# Altium schematic sheet schametic.SchDoc
size 420 x 297 mm; SheetNumber: 1; SheetTotal: 1
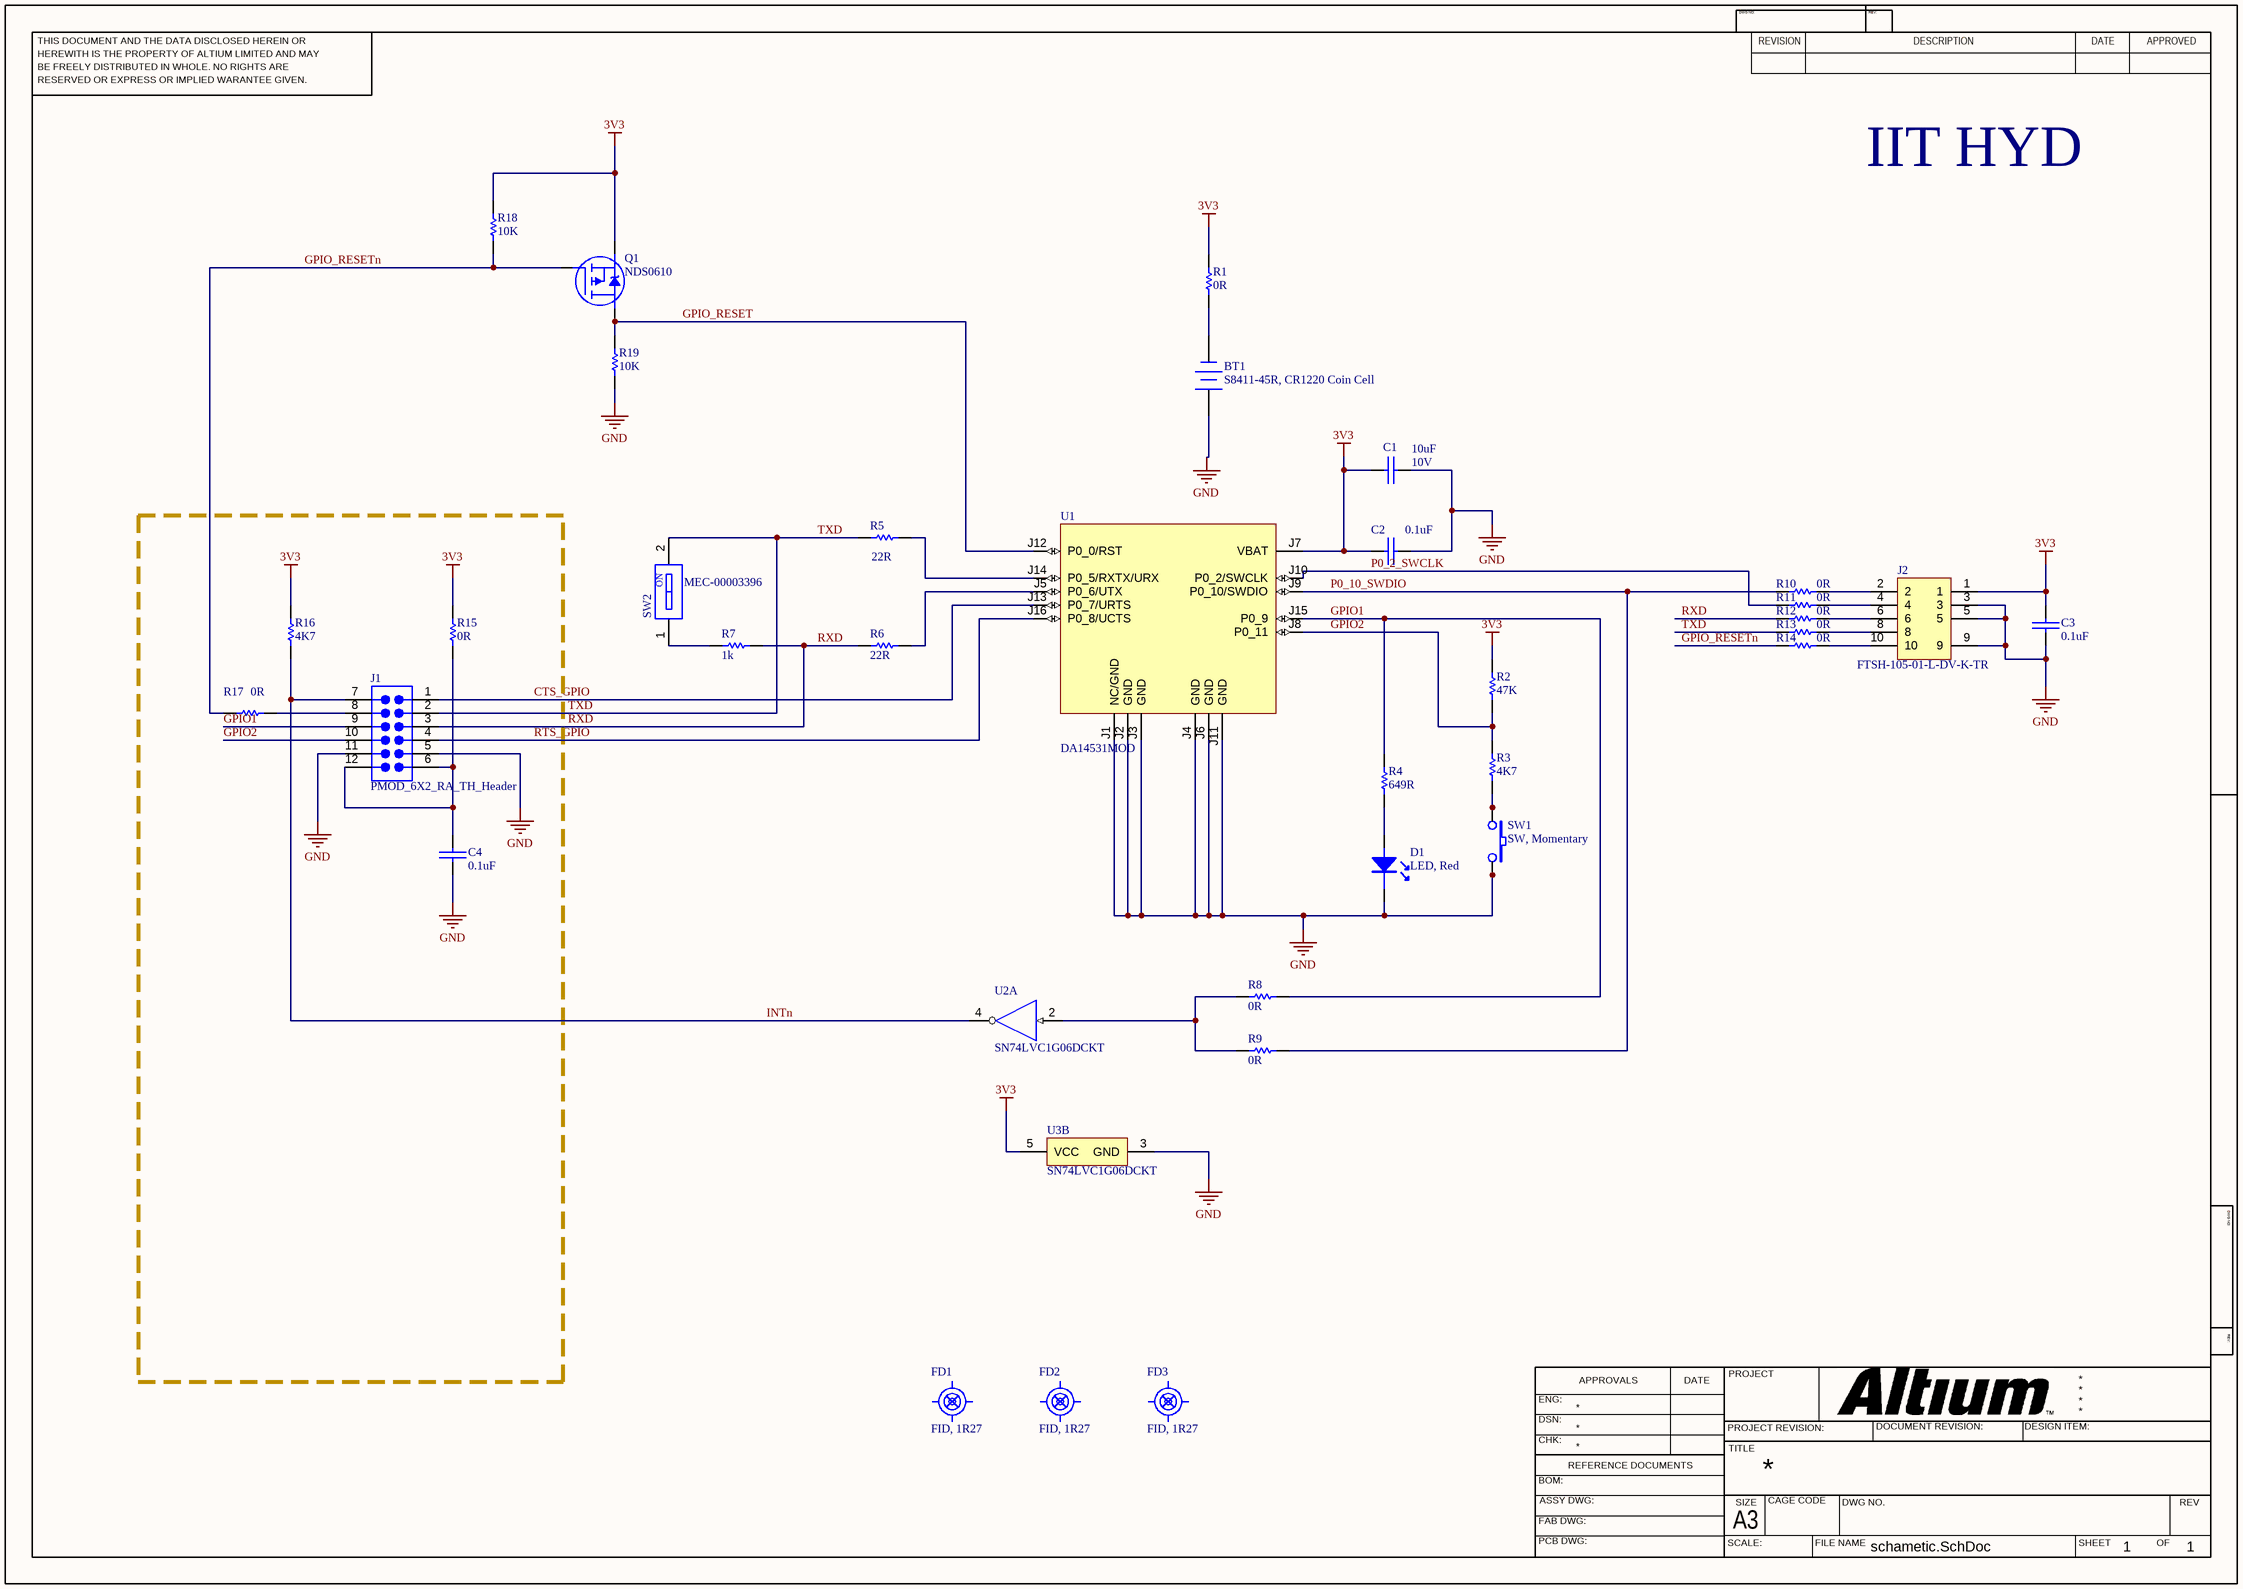
[diagram p0: schametic.SchDoc]

## Parts
BT1  S8411-45R, CR1220 Coin Cell  [HWN_S8411-45R]
C1  10uF  Voltage Rating: 10V  [CAPC1608X10N]
C2  0.1uF  [CAPC1608X09N]
C3  0.1uF  [CAPC1608X09N]
C4  0.1uF  [CAPC1608X09N]
D1  LED, Red  [DIOC2012X08N_WTE]
FD1  FID, 1R27  [FD_ML_1R27]  (no BOM)
FD2  FID, 1R27  [FD_ML_1R27]  (no BOM)
FD3  FID, 1R27  [FD_ML_1R27]  (no BOM)
J1  PMOD_6X2_RA_TH_Header  [PMOD-CONN2X6-RA-TH-HDR]
J2  FTSH-105-01-L-DV-K-TR  [SAM_FTSH-105-01-L-DV-007-K]
Q1  NDS0610  [SOT95P275X112-3NF]
R1  0R  [RESC1608X06N]
R2  47K  [RESC1608X06N]
R3  4K7  [RESC1608X06N]
R4  649R  [RESC1608X06N]
R5  22R  [RESC1608X06N]
R6  22R  [RESC1608X06N]
R7  value 1k  [RESC0603-01]  (hidden comment: RES-100096-01)
R8  0R  [RESC1608X06N]
R9  0R  [RESC1608X06N]
R10  0R  [RESC1608X06N]
R11  0R  [RESC1608X06N]
R12  0R  [RESC1608X06N]
R13  0R  [RESC1608X06N]
R14  0R  [RESC1608X06N]
R15  0R  [RESC1608X06N]
R16  4K7  [RESC1608X06N]
R17  0R  [RESC1608X06N]
R18  10K  [RESC1608X06N]
R19  10K  [RESC1608X06N]
SW1  SW, Momentary  [SW_PTS810]
SW2  MEC-00003396  [416131160801]
U1  DA14531MOD  [DLG_DA14531MOD-00F01002]
U2  SN74LVC1G06DCKT  [SOT65P210X110-5N]  (part A of 2)
U3  SN74LVC1G06DCKT  [SOT65P210X110-5N]  (part B of 2)

## Nets
3V3: C1.1 C2.1 C3.1 J2.1 Q1.S R1.1 R2.1 R15.1 R16.1 R18.1 U1.J7(VBAT) U3.5(VCC)
GND: BT1.1(+) C1.2 C2.2 C3.2 C4.2 D1.K J1.5 J1.11 J2.3 J2.5 J2.9 R19.2 SW1.3 SW1.4 U1.J1(NC/GND) U1.J2(GND) U1.J3(GND) U1.J4(GND) U1.J6(GND) U1.J11(GND) U3.3(GND)
CTS_GPIO: J1.1 U1.J13(P0_7/URTS)
GPIO1: J1.9 R4.1 R8.2 U1.J15(P0_9)
GPIO2: J1.10 R2.2 R3.1 U1.J8(P0_11)
GPIO_RESET: Q1.D R19.1 U1.J12(P0_0/RST)
GPIO_RESETn: Q1.G R14.1 R17.1 R18.2
INTn: J1.7 R16.2 U2.4(Y)
P0_2_SWCLK: R11.1 U1.J10(P0_2/SWCLK)
P0_10_SWDIO: R9.2 R10.1 U1.J9(P0_10/SWDIO)
RTS_GPIO: J1.4 U1.J16(P0_8/UCTS)
RXD: J1.3 R6.1 R7.2 R12.1
TXD: J1.2 R5.1 R13.1 SW2.2
NetBT1_2: BT1.2(-) R1.2
NetC4_1: C4.1 J1.6 J1.12 R15.2
NetD1_A: D1.A R4.2
NetJ1_8: J1.8 R17.2
NetJ2_2: J2.2 R10.2
NetJ2_4: J2.4 R11.2
NetJ2_6: J2.6 R12.2
NetJ2_8: J2.8 R13.2
NetJ2_10: J2.10 R14.2
NetR3_2: R3.2 SW1.1 SW1.2
NetR5_2: R5.2 U1.J14(P0_5/RXTX/URX)
NetR6_2: R6.2 U1.J5(P0_6/UTX)
NetR7_1: R7.1 SW2.1
NetR8_1: R8.1 R9.1 U2.2(A)

## Notes on the sheet
- IIT HYD
- THIS DOCUMENT AND THE DATA DISCLOSED HEREIN OR
- HEREWITH IS THE PROPERTY OF ALTIUM LIMITED AND MAY
- DWG NO:
- REVISION
- REV:
- DESCRIPTION
- DATE
- APPROVED
- BE FREELY DISTRIBUTED IN WHOLE. NO RIGHTS ARE
- RESERVED OR EXPRESS OR IMPLIED WARANTEE GIVEN.
- ENG:
- APPROVALS
- PROJECT
- DSN:
- CHK:
- REFERENCE DOCUMENTS
- PROJECT REVISION:
- TITLE
- DOCUMENT REVISION:
- DESIGN ITEM:
- BOM:
- FAB DWG:
- PCB DWG:
- ASSY DWG:
- SCALE:
- A3
- SIZE
- CAGE CODE
- FILE NAME
- DWG NO.
- SHEET
- OF
- REV
- (in symbol CMP-011-00036-1) ON

## Library data of the parts
BT1 = BT-S8411-45R-SR-HWN: Battery Holder, 12 mm Coin Cell, CR1220 SM; Manufacturer: Harwin; Detailed Description: Battery Holder, 12 mm Coin Cell, CR1220, SM, RoHS; Part: S8411-45R, CR1220 Coin Cell; Type: Battery Holder; Manufacturer's Part #: S8411-45R; Revision: 1; Supplier 1: Digi-Key; Supplier 2: Mouser; Supplier Part Number 1: 952-1745-1-ND; Supplier Part Number 2: 855-S8411-45R
C1 = CI-10uF-10V-X5R-SR-MRT: Capacitor, 10uF, 10V, SM; Manufacturer's Part #: GRM188R61A106KE69D; Manufacturer: Murata; Detailed Description: Capacitor, 10uF, 10V, SM 0603, Multilayer Ceramic, X5R, RoHS; Tolerance: 10%; Part: 10uF; Type: Capacitor; Revision: 1; Supplier 1: Digi-Key; Supplier 2: Mouser; Supplier Part Number 1: 490-10474-1-ND; Supplier Part Number 2: 81-GRM188R61A106KE9D; Package: 0603
C2-C4 = CI-0.1uF-50V-X7R-SR-YAG: Capacitor, 0.1uF, 50V, SM; Manufacturer's Part #: CC0603KRX7R9BB104; Manufacturer: Yageo; Detailed Description: Capacitor, 0.1uF, 50V, SM 0603, Multilayer Ceramic,, X7R, RoHS; Tolerance: 10%; Part: 0.1uF; Type: Capacitor; Revision: 1; Package: 0603; Voltage Rating: 50V; Supplier 1: Digi-Key; Supplier 2: Future Electronics; Supplier 3: Mouser; Supplier Part Number 1: 311-1344-1-ND; Supplier Part Number 2: 9017302; Supplier Part Number 3: 603-CC603KRX7R9BB104
D1 = DA-150080RS75000-SR-WTE: LED, Red, 0805 SM; Manufacturer: Wurth Elektronik; Detailed Description: LED, Red, Clear, 0805, SM, RoHS; Part: LED, Red; Type: LED; Manufacturer's Part #: 150080RS75000; Revision: 1; Package: 0805; Supplier 1: Digi-Key; Supplier 2: Mouser; Supplier Part Number 1: 732-4984-1-ND; Supplier Part Number 2: 710-150080RS75000
FD1-FD3 = FD-ML1R27-SR-BDH: Fiducial, 1.27mm D, Multilayer; Manufacturer: PCB Fabricator; Detailed Description: Fiducial, 1.27mm D, Multilayer, RoHS; Part: FID, 1R27; Type: Fiducial; Revision: 1
J1 = CMP-024-000000-2: Male Header 0.1" pitch PMOD 2x6 Right Angle, through hole; Manufacturer 1: Wurth; Manufacturer Part Number 1: 61301221021; Pitch: 2.54mm; Positions: 12; Manufacturer Part Number 2: TSW-106-08-F-D-RA; Manufacturer Part Number 3: M20-9950645; Manufacturer 3: Harwin; Manufacturer 2: Samtec Inc.; Source: PMOD_Conn.SchLib; Design Item ID: PMOD_6X2_RA_TH_Header
J2 = JH-2X5VH-FTSH-105-01-L-DV-007-K-SR-SAM: Connector, 2X5 Header, Vertical, 1.27mm Pitch, Pin 7, SM; Manufacturer: Samtec; Detailed Description: Connector, 2X5 Header, Vertical, 1.27mm Pitch, Pin 7, SM, RoHS; Current Rating: 3.4A (max. 2 pins); Part: FTSH-105-01-L-DV-K-TR; Type: Connector; Manufacturer's Part #: FTSH-105-01-L-DV-007-K; Supplier 1: Digi-Key; Supplier 2: Mouser; Supplier Part Number 1: SAM9438-ND; Supplier Part Number 2: 200-FTSH10501LDV007K; Revision: 1
Q1 = QA-NDS0610-SR-ONS: Transistor, P-Ch Mosfet, 60V, 120mA, 10Ohm, SM; Manufacturer: On Semiconductor; Type: N-Ch Mosfet; Detailed Description: Transistor, P-Ch Mosfet, 60V, 120mA, 10Ohm, SM, SOT23-3, RoHS; Part: NDS0610; Manufacturer's Part #: NDS0610; Revision: 1; Current Rating: 120mA; Package: SOT23-3; Resistance: 10Ohm; Voltage Rating: 60V; Supplier 1: Digi-Key; Supplier 2: Newark; Supplier 3: Mouser; Supplier Part Number 1: NDS0610CT-ND; Supplier Part Number 2: 58K2015; Supplier Part Number 3: 512-NDS0610
R1 R8-R15 R17 = RP-0-SR-KOA: Resistor, 0 ohms, 1/8W, 1%, SM; Manufacturer's Part #: RK73Z1JTTD; Manufacturer: KOA Speer; Detailed Description: Resistor, 0 ohms, 1/8W, 1%, 100 ppm, SM, 75 WV, 100 OV, Thick Film, 0603, RoHS; Voltage Rating: 75V; Resistance: 0; Part: 0R; Type: Resistor; Revision: 1; Power Rating: 1/8W; Tolerance: 1%; Package: 0603; Supplier 1: Arrow Electronics; Supplier 2: Digi-Key; Supplier 3: Mouser; Supplier Part Number 1: RK73Z1JTTD; Supplier Part Number 2: 2019-RK73Z1JTTDCT-ND; Supplier Part Number 3: 660-RK73Z1JTTD
R2 = RP-47K-SR-KOA: Resistor, 47K ohms, 1/8W, 1%, SM; Manufacturer's Part #: RK73H1JTTD6802F; Manufacturer: KOA Speer; Detailed Description: Resistor, 47K ohms, 1/8W, 1%, 100 ppm, SM, 75 WV, 100 OV, Thick Film, 0603, RoHS; Voltage Rating: 75V; Part: 47K; Type: Resistor; Revision: 1; Power Rating: 1/8W; Tolerance: 1%; Resistance: 47K; Package: 0603; Supplier 1: Digi-Key; Supplier 2: Mouser; Supplier 3: Arrow Electronics; Supplier Part Number 1: 2019-RK73H1JTTD6802FCT-ND; Supplier Part Number 2: 660-RK73H1JTTD6802F; Supplier Part Number 3: RK73H1JTTD6802F
R3 R16 = RP-4.7K-SR-KOA: Resistor, 4.7K ohms, 1/8W, 1%, SM; Manufacturer's Part #: RK73H1JTTD4701F; Manufacturer: KOA Speer; Detailed Description: Resistor, 4.7K ohms, 1/8W, 1%, 100 ppm, SM, 75 WV, 100 OV, Thick Film, 0603, RoHS; Voltage Rating: 75V; Part: 4K7; Type: Resistor; Revision: 1; Power Rating: 1/8W; Tolerance: 1%; Resistance: 4.7K; Package: 0603; Supplier 1: Digi-Key; Supplier 2: Mouser; Supplier Part Number 1: 2019-RK73H1JTTD4701FCT-ND; Supplier Part Number 2: 660-RK73H1JTTD4701F
R4 = RP-649-SR-KOA: Resistor, 649 ohms, 1/8W, 1%, SM; Manufacturer's Part #: RK73H1JTTD6490F; Manufacturer: KOA Speer; Detailed Description: Resistor, 649 ohms, 1/8W, 1%, 100 ppm, SM, 75 WV, 100 OV, Thick Film, 0603, RoHS; Voltage Rating: 75V; Resistance: 649; Part: 649R; Type: Resistor; Revision: 1; Power Rating: 1/8W; Tolerance: 1%; Package: 0603; Supplier 1: Digi-Key; Supplier 2: Mouser; Supplier 3: Arrow Electronics; Supplier Part Number 1: 2019-RK73H1JTTD6490FCT-ND; Supplier Part Number 2: 660-RK73H1JTTD6490F; Supplier Part Number 3: RK73H1JTTD6490F
R5 R6 = RP-22-SR-KOA: Resistor, 22 ohms, 1/8W, 1%, SM; Manufacturer's Part #: RK73H1JTTD22R0F; Manufacturer: KOA Speer; Detailed Description: Resistor, 22 ohms, 1/8W, 1%, 100 ppm, SM, 75 WV, 100 OV, Thick Film, 0603, RoHS; Voltage Rating: 75V; Resistance: 22; Part: 22R; Type: Resistor; Revision: 1; Power Rating: 1/8W; Tolerance: 1%; Package: 0603; Supplier 1: Digi-Key; Supplier 2: Arrow Electronics; Supplier 3: Mouser; Supplier Part Number 1: 2019-RK73H1JTTD22R0FCT-ND; Supplier Part Number 2: RK73H1JTTD22R0F; Supplier Part Number 3: 660-RK73H1JTTD22R0F
R7 = CMP-009-00240-1: Chip Resistor Thick Film 0603 1K0 ohm 1% 1/10W; Manufacturer 1: Vishay Dale; Power: 100mW; PN: CRCW06031K00FKEAC; Design Item ID: RES-100096-01; Pins: 2; Tolerance: 1%; Mfg: Vishay Dale; Case/Package: 0603; Mfg Part Number: CRCW06031K00FKEAC; Manufacturer: Vishay Dale; Manufacturer Part Number 1: CRCW06031K00FKEAC; Component Type: Standard; Source: AME-MPU-RZA3UL_v1.SCHLIB
R18 R19 = RP-10K-SR-KOA: Resistor, 10K ohms, 1/8W, 1%, SM; Manufacturer's Part #: RK73H1JTTD1002F; Manufacturer: KOA Speer; Detailed Description: Resistor, 10K ohms, 1/8W, 1%, 100 ppm, SM, 75 WV, 100 OV, Thick Film, 0603, RoHS; Voltage Rating: 75V; Part: 10K; Type: Resistor; Revision: 1; Power Rating: 1/8W; Tolerance: 1%; Resistance: 10K; Package: 0603; Supplier 1: Digi-Key; Supplier 2: Mouser; Supplier 3: Arrow Electronics; Supplier Part Number 1: 2019-RK73H1JTTD1002FCT-ND; Supplier Part Number 2: 660-RK73H1JTTD1002F; Supplier Part Number 3: RK73H1JTTD1002F
SW1 = SW-PTS810SJG250-SR-CKC: Switch, Pushbutton, Top Actuated, SM; Manufacturer's Part #: PTS810 SJG 250 SMTR LFS; Manufacturer: C&K Components; Detailed Description: Switch, Pushbutton, Top Actuated, SM, RoHS; Part: SW, Momentary; Type: Switch, Pushbutton; Revision: 1; Supplier 1: Digi-Key; Supplier 2: Newark; Supplier Part Number 1: CKN10504CT-ND; Supplier Part Number 2: 35AH5293
SW2 = CMP-011-00036-1: WS-DISV Small Compact SMT Flat Actuator with Top Tape 1.27 mm; Manufacturer 1: Wurth Elektronik; Current: 100mA; Value: 416131160801; Voltage: 50V; Checked: OK; Height: 2.65; Operating Temperature: -40~85°C; ComponentLink1URL: https://ree-du1svn.ree.adwin.renesas.com/du1svn2/REE_PCB_ACLIB/ADLib/pdf/00003396_416131160801.pdf; Category: Mechanical; Manufacturer Part Number 1: 416131160801; PartNumber: MEC-00003396; Pins: 2; ComponentLink1Description: Datasheet
U1 = UD-DA14531MOD-00F01002-SR-DLG: DA14531MOD, Bluetooth Low Energy 5.1 Module, SM; Manufacturer 1: Renesas Electronics; Detailed Description: DA14531MOD, Bluetooth Low Energy 5.1 Module, 128 kB Flash, 144kB ROM, 48kB RAM, 16-SMD Module, SM, RoHS; Manufacturer Part Number 1: DA14531MOD-00F01002; Part: DA14531MOD; Type: BLE 5.1 Module; Revision: 1; Package: 16-SMD Module; Supplier 1: Digi-Key; Supplier 2: Mouser; Supplier Part Number 1: 1695-DA14531MOD-00F01002CT-ND; Supplier Part Number 2: 724-DA14531MODF01002
U2 U3 = UD-SN74LVC1G06DCKT-SR-TXI: IC, Digital, Buffer,  Inverting, Open Drain, SM; Manufacturer: Texas Instruments; Alternate Part #: SN74LVC1G07DCKR; Detailed Description: IC, Digital, Buffer, Inverting, Open Drain, SM, SC-70-5, RoHS; Manufacturer's Part #: SN74LVC1G06DCKT; Part: SN74LVC1G06DCKT; Type: Buffer; Package: SC-70-5; Alternate Part Supplier: Texas Instruments; Revision: 1; Supplier 1: Digi-Key; Supplier 2: Mouser; Supplier 3: Arrow Electronics; Supplier Part Number 1: 296-32290-1-ND; Supplier Part Number 2: 595-SN74LVC1G06DCKT; Supplier Part Number 3: SN74LVC1G06DCKT